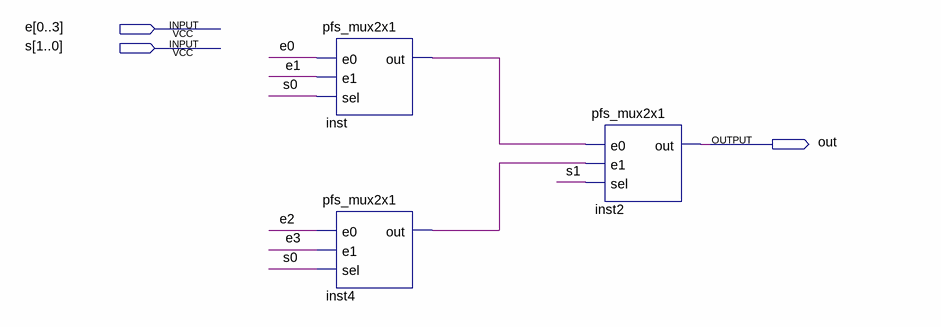
[diagram p0: schematic sheet]
// Quartus schematic pfs_mux4x1.bdf as structural Verilog: 3 symbols, 3 pins
module pfs_mux4x1 (
  input  [0:3] e,
  input  [1:0] s,
  output out
);

  wire inst4_out, inst_out;

  pfs_mux2x1 inst (.e0(e[0]), .e1(e[1]), .sel(s[0]), .out(inst_out));
  pfs_mux2x1 inst4 (.e0(e[2]), .e1(e[3]), .sel(s[0]), .out(inst4_out));
  pfs_mux2x1 inst2 (.e0(inst_out), .e1(inst4_out), .sel(s[1]), .out(out));
endmodule
